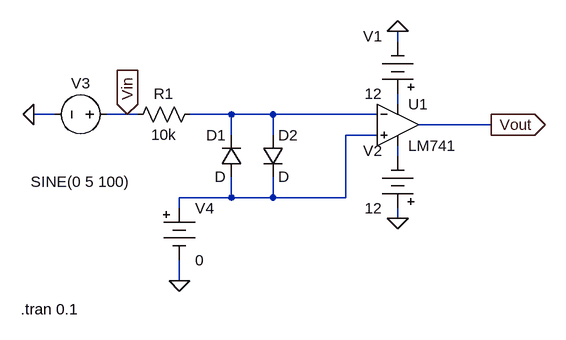
[diagram p0: schematic Draft3.asc]
Draft3.asc, the LTspice schematic file:
Version 4
SHEET 1 880 680
WIRE 240 16 240 0
WIRE 240 112 240 96
WIRE -288 128 -320 128
WIRE -176 128 -208 128
WIRE -160 128 -176 128
WIRE -16 128 -80 128
WIRE 48 128 -16 128
WIRE 208 128 48 128
WIRE 384 144 272 144
WIRE -16 160 -16 128
WIRE 48 160 48 128
WIRE 208 160 160 160
WIRE 240 192 240 176
WIRE -16 256 -16 224
WIRE -16 256 -96 256
WIRE 48 256 48 224
WIRE 48 256 -16 256
WIRE 160 256 160 160
WIRE 160 256 48 256
WIRE -96 272 -96 256
WIRE 240 288 240 272
WIRE -96 384 -96 352
FLAG 240 288 0
FLAG 240 0 0
FLAG -320 128 0
FLAG -96 384 0
FLAG 384 144 Vout
IOPIN 384 144 Out
FLAG -176 128 Vin
IOPIN -176 128 In
SYMBOL OpAmps\\LM741 240 80 R0
SYMATTR InstName U1
SYMBOL Misc\\battery 240 112 R180
WINDOW 0 24 104 Left 2
WINDOW 3 24 16 Left 2
WINDOW 123 0 0 Left 0
WINDOW 39 0 0 Left 0
SYMATTR InstName V1
SYMATTR Value 12
SYMBOL Misc\\battery 240 288 R180
WINDOW 0 24 104 Left 2
WINDOW 3 24 16 Left 2
WINDOW 123 0 0 Left 0
WINDOW 39 0 0 Left 0
SYMATTR InstName V2
SYMATTR Value 12
SYMBOL res -64 112 R90
WINDOW 0 0 56 VBottom 2
WINDOW 3 32 56 VTop 2
SYMATTR InstName R1
SYMATTR Value 10k
SYMBOL voltage -192 128 R90
WINDOW 0 -32 56 VBottom 2
WINDOW 3 88 56 VTop 2
WINDOW 123 60 56 VTop 2
WINDOW 39 0 0 Left 0
SYMATTR InstName V3
SYMATTR Value SINE(0 5 100)
SYMBOL diode 0 224 R180
WINDOW 0 24 64 Left 2
WINDOW 3 24 0 Left 2
SYMATTR InstName D1
SYMBOL diode 32 160 R0
SYMATTR InstName D2
SYMBOL Misc\\battery -96 256 R0
WINDOW 123 0 0 Left 0
WINDOW 39 0 0 Left 0
SYMATTR InstName V4
SYMATTR Value 0
TEXT -340 428 Left 2 !.tran 0.1

The netlist it stands for:
* Draft3.asc
XU1 N003 N002 N001 N004 Vout LM741  ; pins In+ In- V+ V- OUT
V1 N001 0 12
V2 0 N004 12
R1 N002 Vin 10k
V3 Vin 0 SINE(0 5 100)
D1 N003 N002 D
D2 N002 N003 D
V4 N003 0 0
.model D D
.lib standard.dio
.tran 0.1
.lib LM741.lib
.backanno
.end